# EAGLE design p2009-v26_phoneadapter (EAGLE 5.04)
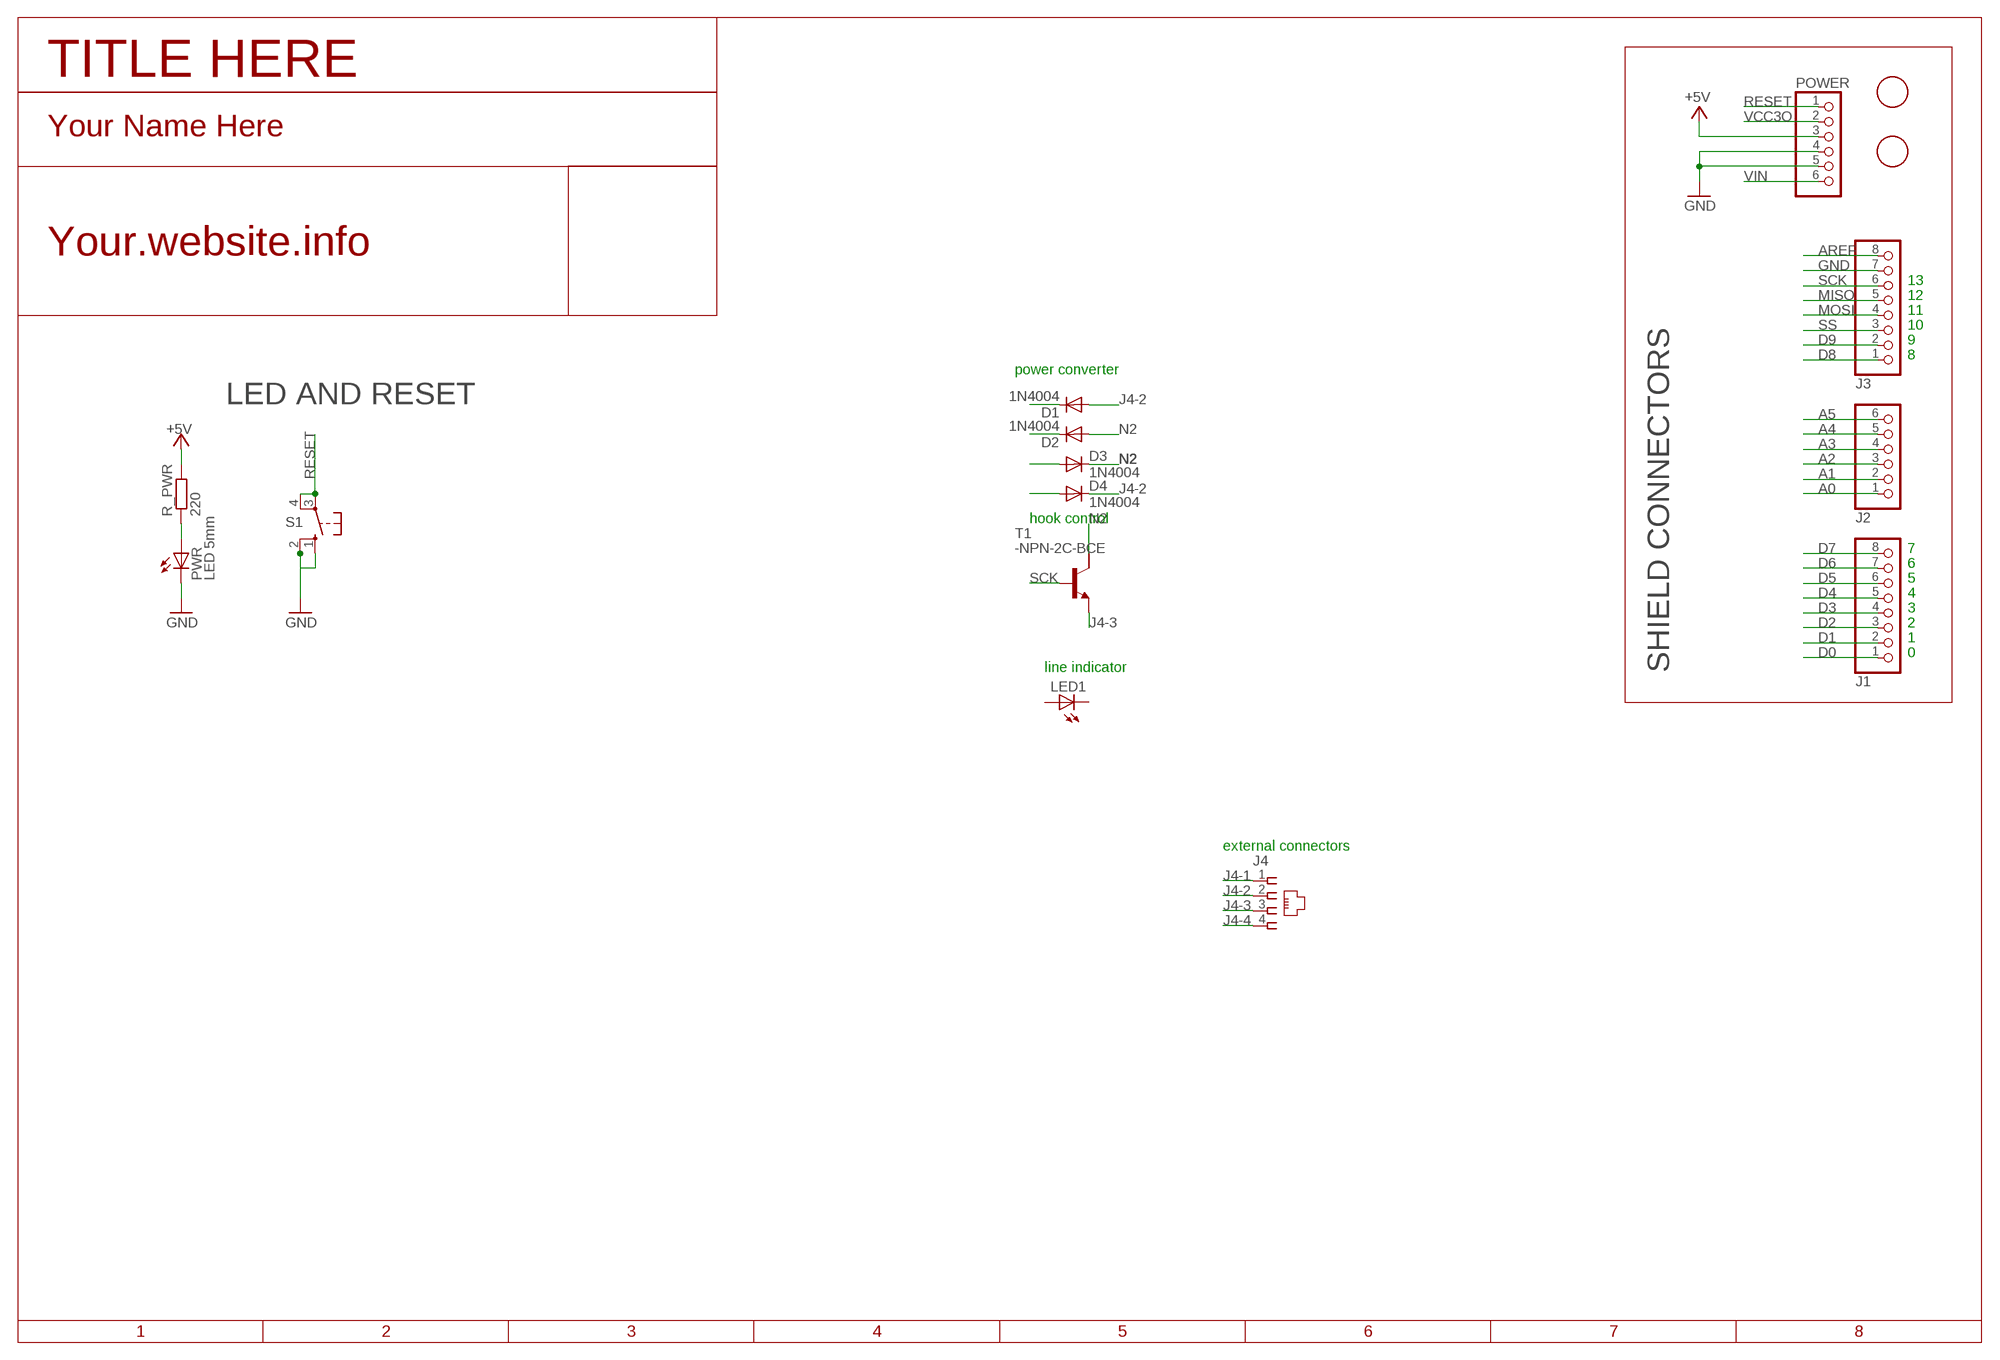
[diagram p0: schematic, sheet 1]

## Parts
D1  1N4004  [DO41-10]
D2  1N4004  [DO41-10]
D3  1N4004  [DO41-10]
D4  1N4004  [DO41-10]
J1  PINHD-1X8  [1X08]
J2  PINHD-1X6  [1X06]
J3  PINHD-1X8  [1X08]
J4  215875-3  [215875-3]
LED1  LED3MM  [LED3MM]
POWER  PINHD-1X6  [1X06]
PWR  LED 5mm  LED3MM  [LED3MM]
R_PWR  220  RR0207/10  [R0207/10]
S1  pushbutton  10-XX  [B3F-10XX]
T1  -NPN-2C-BCE  [SOT89-BCE]
U$1  FIDUCIALMOUNT  [FIDUCIA-MOUNT]
U$3  FIDUCIALMOUNT  [FIDUCIA-MOUNT]

## Nets
+5V [usbvcc]: POWER.3 R_PWR.2
A0: J2.1
A1: J2.2
A2: J2.3
A3: J2.4
A4: J2.5
A5: J2.6
AREF [aref]: J3.8
D0: J1.1
D1: J1.2
D2: J1.3
D3: J1.4
D4: J1.5
D5: J1.6
D6: J1.7
D7: J1.8
D8: J3.1
D9: J3.2
GND [gnd]: J3.7 POWER.4 POWER.5 PWR.K(C) S1.1(S) S1.2(S1)
J4-1: J4.1
J4-2: D1.A D4.C J4.2
J4-3: J4.3 T1.E
J4-4: J4.4
MISO: J3.5
MOSI: J3.4
N2: D2.A D3.C T1.C
N$1: D1.C
N$2: D2.C
N$3: D3.A
N$4: PWR.A R_PWR.1
N$5: D4.A
RESET: POWER.1 S1.3(P) S1.4(P1)
SCK: J3.6 T1.B
SS: J3.3
VCC3O: POWER.2
VIN [power]: POWER.6
Unconnected: LED1.A LED1.K(C) T1.C@1(C)

## Notes on the sheet
- TITLE HERE
- Your Name Here
- Your.website.info
- 13
- 12
- 11
- 10
- 9
- 8
- power converter
- LED AND RESET
- hook control
- 7
- 6
- 5
- 4
- 3
- 2
- 1
- 0
- line indicator | SHIELD CONNECTORS
- external connectors

## Library data of the parts
D1-D4 = diode:1N4004: DIODE general purpose rectifier, 1 A
J1 J3 = pinhead:PINHD-1X8: PIN HEADER
J2 POWER = pinhead:PINHD-1X6: PIN HEADER
J4 = con-amp:215875-3: AMP connector
LED1 PWR = led:LED: LED OSRAM: - CHIPLED LG R971, LG N971, LY N971, LG Q971, LY Q971, LO R971, LY R971 LH N974, LH R974 LS Q976, LO Q976, LY Q976 LO Q996 - Hyper CHIPLED LW Q18S LB Q993, LB Q99A, LB R99A - SideLED LS A670, LO A670, LY A670, LG A670, LP A670 LB A673, LV A673, LT A673, LW A673 LH A674 LY A675 LS A676, LA A676, LO A676, LY A676, LW A676 LS A679, LY A679, LG A679 - Hyper Micro SIDELED® LS Y876, LA Y876, LO Y876, LY Y876 LT Y87S - SmartLED LW L88C, LW L88S LB L89C, LB L89S, LG L890 LS L89K, LO L89K, LY L89K LS L896, LA L896, LO L896, LY L896 - TOPLED LS T670, LO T670, LY T670, LG T670, LP T670 LSG T670, LSP T670, LSY T670, LOP T670, LYG T670 LG T671, LOG T671, LSG T671 LB T673, LV T673, LT T673, LW T673 LH T674 LS T676, LA T676, LO T676, LY T676, LB T676, LH T676, LSB T676, LW T676 LB T67C, LV T67C, LT T67C, LS T67K, LO T67K, LY T67K, LW E67C LS E67B, LA E67B, LO E67B, LY E67B, LB E67C, LV E67C, LT E67C LW T67C LS T679, LY T679, LG T679 LS T770, LO T770, LY T770, LG T770, LP T770 LB T773, LV T773, LT T773, LW T773 LH T774 LS E675, LA E675, LY E675, LS T675 LS T776, LA T776, LO T776, LY T776, LB T776 LHGB T686 LT T68C, LB T68C - Hyper Mini TOPLED® LB M676 - Mini TOPLED Santana® LG M470 LS M47K, LO M47K, LY M47K Source: http://www.osram.convergy.de LUXEON: - LUMILED® LXK2-PW12-R00, LXK2-PW12-S00, LXK2-PW14-U00, LXK2-PW14-V00 LXK2-PM12-R00, LXK2-PM12-S00, LXK2-PM14-U00 LXK2-PE12-Q00, LXK2-PE12-R00, LXK2-PE12-S00, LXK2-PE14-T00, LXK2-PE14-U00 LXK2-PB12-K00, LXK2-PB12-L00, LXK2-PB12-M00, LXK2-PB14-N00, LXK2-PB14-P00, LXK2-PB14-Q00 LXK2-PR12-L00, LXK2-PR12-M00, LXK2-PR14-Q00, LXK2-PR14-R00 LXK2-PD12-Q00, LXK2-PD12-R00, LXK2-PD12-S00 LXK2-PH12-R00, LXK2-PH12-S00 LXK2-PL12-P00, LXK2-PL12-Q00, LXK2-PL12-R00 Source: www.luxeon.com KINGBRIGHT: KA-3528ASYC Source: www.kingbright.com
R_PWR = blushingboy_experimental:R
S1 = switch-omron:10-XX: OMRON SWITCH
T1 = transistor:*-NPN-2C-: NPN Transistor with 2 Collector pins
U$1 U$3 = SmartPrj:FIDUCIALMOUNT

## Net classes
0 default: width 0.254 mm, drill 0.305 mm, clearance 0.152 mm
1 power: width 0.61 mm, drill 0.508 mm, clearance 0.152 mm
2 gnd: width 0.305 mm, drill 0.508 mm, clearance 0.152 mm
3 usbvcc: width 0.508 mm, drill 0.508 mm, clearance 0.152 mm
4 aref: width 0.406 mm

## Board
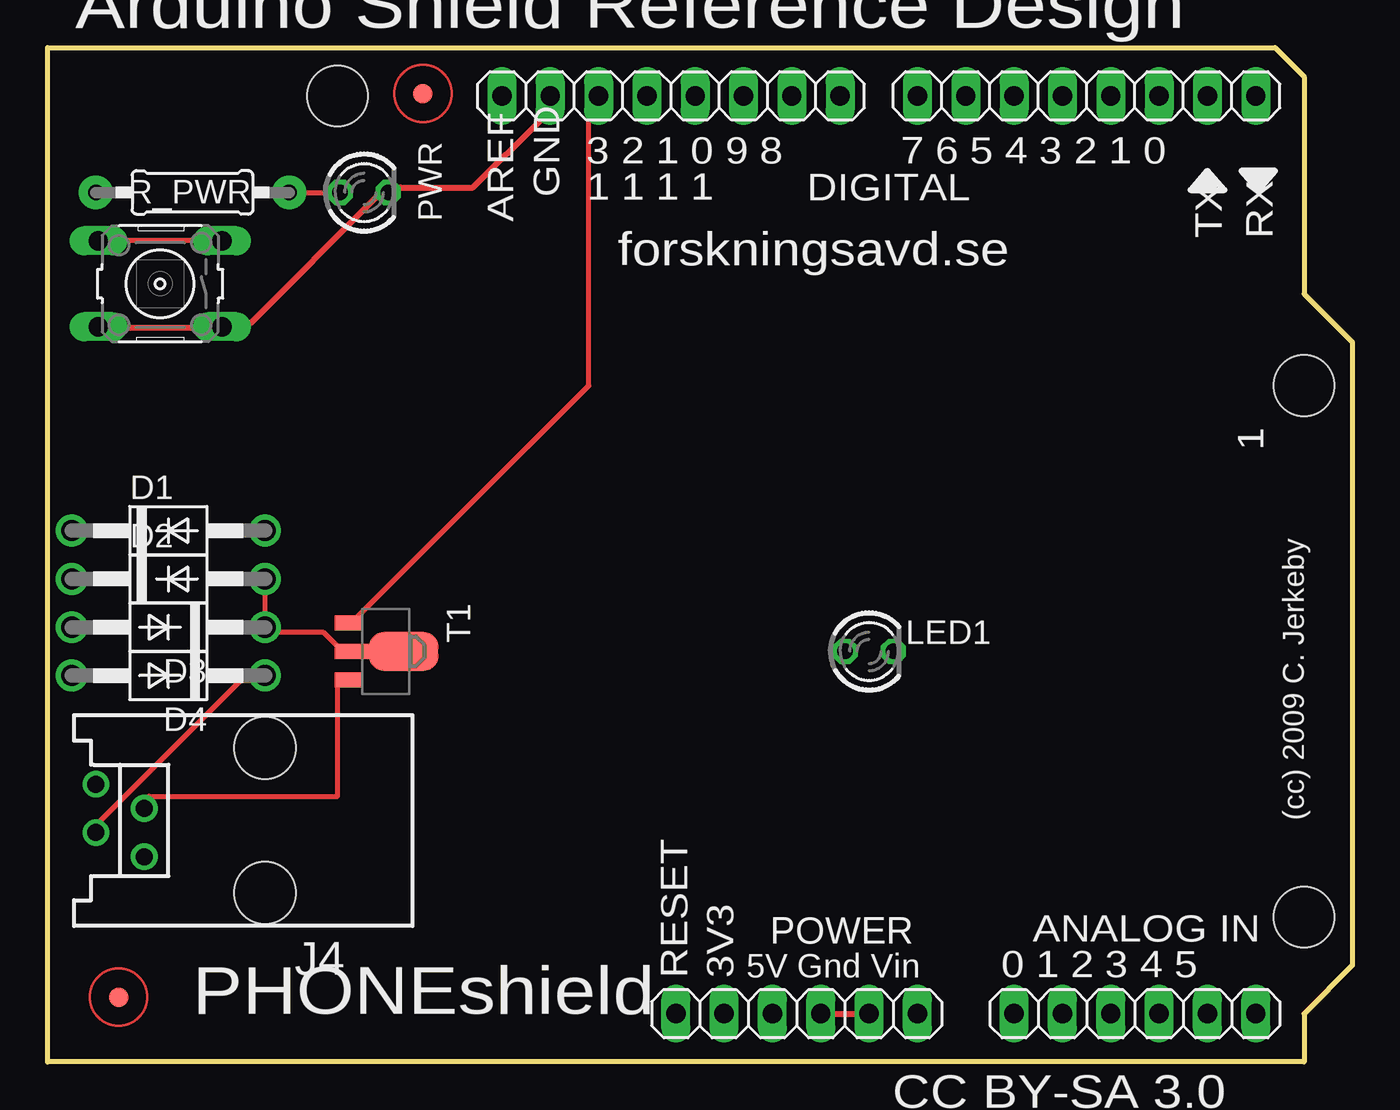
[diagram p1: board, top side]
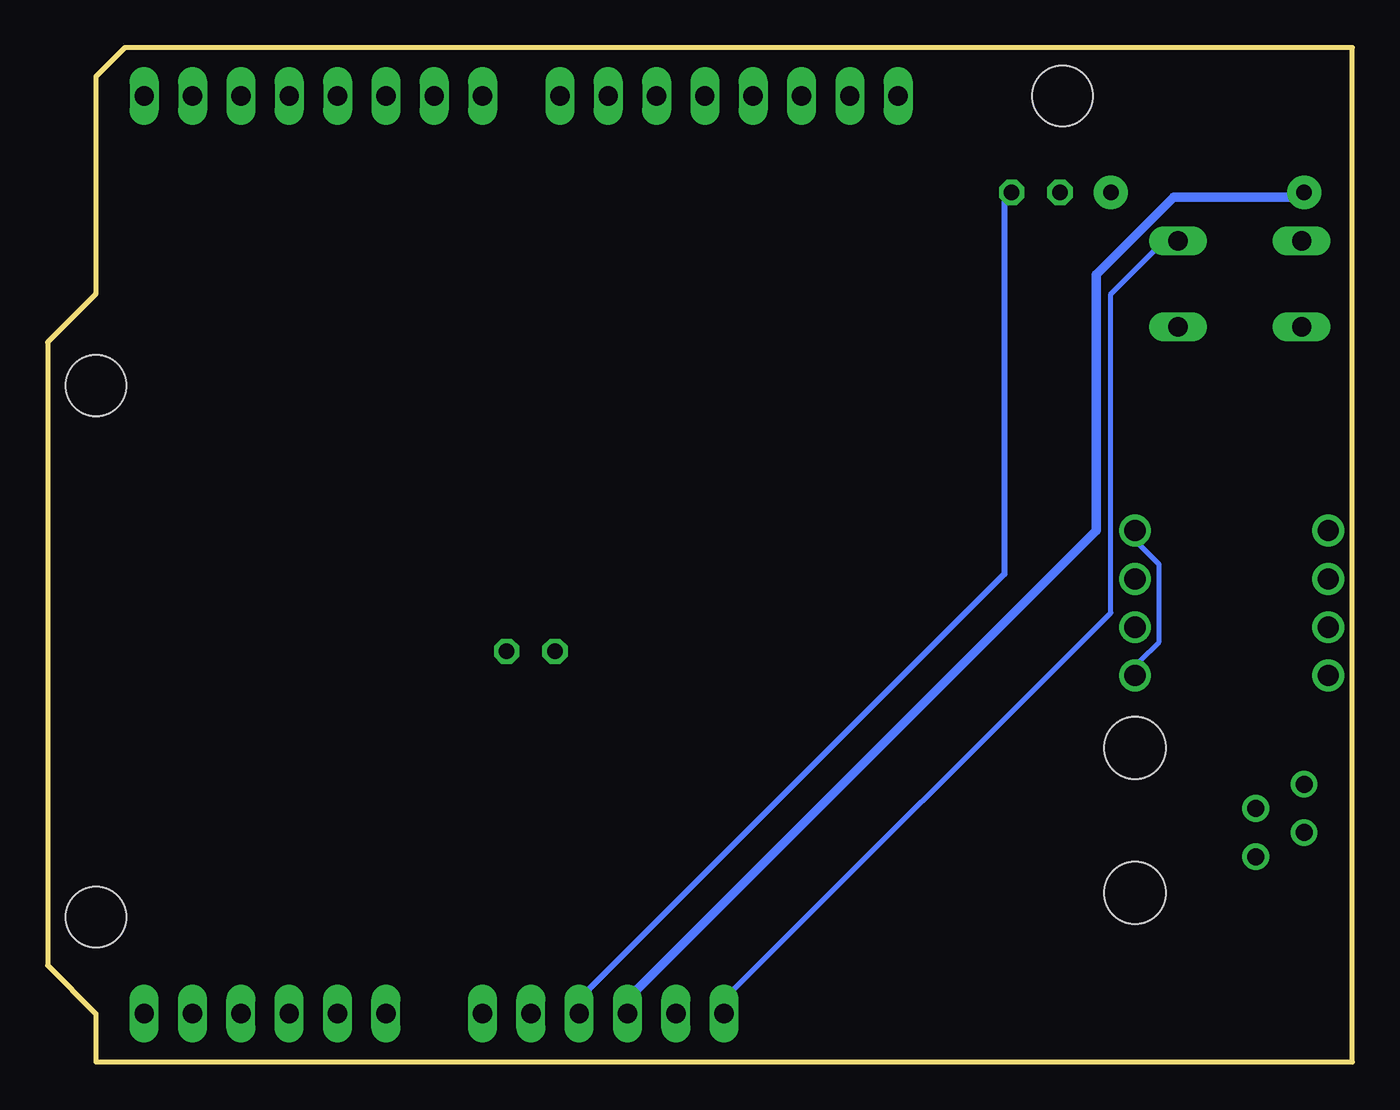
[diagram p2: board, bottom side, seen from below]

Size 68.58 x 53.34 mm. Coordinates in mm from the lower left corner, seen from the top.
Outline: 0,53.34 64.52,53.34 66.04,51.82 66.04,40.39 68.58,37.85 68.58,5.08 66.04,2.54 66.04,0 0,0 0,53.34
Copper layers (1*16): Top 0.035mm / dielectric 1.5mm / Bottom 0.035mm
Design rules "default *": minimum track width 6mil, minimum drill 12mil, track to track 6mil, track to pad 6mil, pad to pad 6mil, via to via 6mil, smd to smd 6mil, copper to edge 30mil, drill to drill 6mil, minimum pad ring 10mil, minimum via ring 10mil, stop-mask expansion 4mil, vias tented up to drill 0mil, thermal gap 10mil
Holes 3.2 mm at 66.04,35.56 66.04,7.62 15.24,50.8

### Footprints (pad centres in the part's own frame; a part is rotated, then mirrored left to right if it is on the bottom)
DO41-10 = drill 1.118 round: A 5.08,0; C -5.08,0
1X08 = drill 1.016 long: 1 -8.89,0; 2 -6.35,0; 3 -3.81,0; 4 -1.27,0; 5 1.27,0; 6 3.81,0; 7 6.35,0; 8 8.89,0
1X06 = drill 1.016 long: 1 -6.35,0; 2 -3.81,0; 3 -1.27,0; 4 1.27,0; 5 3.81,0; 6 6.35,0
215875-3 = drill 0.889 round: 1 -1.905,6.35; 2 -0.635,8.89; 3 0.635,6.35; 4 1.905,8.89 | hole 3.251: -3.81,0; 3.81,0
LED3MM = drill 0.813 octagon: A -1.27,0; K 1.27,0
R0207/10 = drill 0.813 pad 1.778 round: 1 0,0; 2 10.16,0
B3F-10XX = drill 1.016 long: 1 -3.251,2.261; 2 3.251,2.261; 3 -3.251,-2.261; 4 3.251,-2.261
SOT89-BCE = smd 0.8 x 1.4: B -1.499,-1.981; E 1.499,-1.981 | smd 0.8 x 1.9: C 0,-1.727 | smd 2.032 x 3.65: C@1 0,0.94
FIDUCIA-MOUNT = smd 1.016 x 1.016: P$1 0,0

### Placement (x,y rotation side)
D1  6.35,27.94 0 top
D2  6.35,25.4 0 top
D3  6.35,22.86 180 top
D4  6.35,20.32 180 top
J1  54.61,50.8 180 top
J2  57.15,2.54 0 top
J3  32.77,50.8 180 top
J4  11.43,12.7 90 top
LED1  43.18,21.59 0 top
POWER  39.37,2.54 0 top
PWR  16.64,45.72 0 top
R_PWR  12.7,45.72 180 top
S1  5.92,40.92 180 top
T1  17.78,21.59 270 top
U$1  19.73,50.92 0 top
U$3  3.73,3.41 0 top

### Tracks (layer width: path | path; a pad name or v marks a point on that pad's centre or on a via)
+5V
  Bottom 0.508: POWER.3 37.59,3.81 13.46,27.94 13.46,41.4 9.4,45.47 3.3,45.47 R_PWR.2
GND
  Top 0.305: POWER.4 POWER.5 | S1.2 4.06,38.61 7.87,38.61 S1.1 10.67,38.86 17.27,45.47 PWR.K 18.54,45.97 22.35,45.97 25.91,49.53 J3.7
  Bottom 0.305: POWER.4 40.13,3.81 18.29,25.65 18.29,45.21 PWR.K
J4-2
  Top 0.254: J4.2 2.79,12.7 10.16,20.07 10.67,20.07 D4.C
  Bottom 0.254: D1.A 11.18,27.18 10.16,26.16 10.16,22.1 11.18,21.08 D4.C
J4-3
  Top 0.254: T1.E 15.24,19.81 15.24,13.97 5.33,13.97 J4.3
N2
  Top 0.254: T1.C 15.24,21.84 14.48,22.61 12.19,22.61 D3.C D2.A
N$4
  Top 0.254: R_PWR.1 PWR.A
RESET
  Top 0.254: S1.3 S1.4
  Bottom 0.254: POWER.1 32.51,3.81 12.7,23.62 12.7,40.39 10.41,42.67 S1.3
SCK
  Top 0.254: T1.B 16.26,23.37 28.45,35.56 28.45,49.53 J3.6

### Text on the board
tNames: Arduino Shield Reference Design | 3 2 1 0 9 8 | 7 6 5 4 3 2 1 0 | GND | 1 1 1 1 | DIGITAL | AREF | TX | RX | forskningsavd.se | 1 | (cc) 2009 C. Jerkeby | ANALOG IN | RESET | 3V3 | 5V Gnd Vin | 0 1 2 3 4 5 | PHONEshield | CC BY-SA 3.0